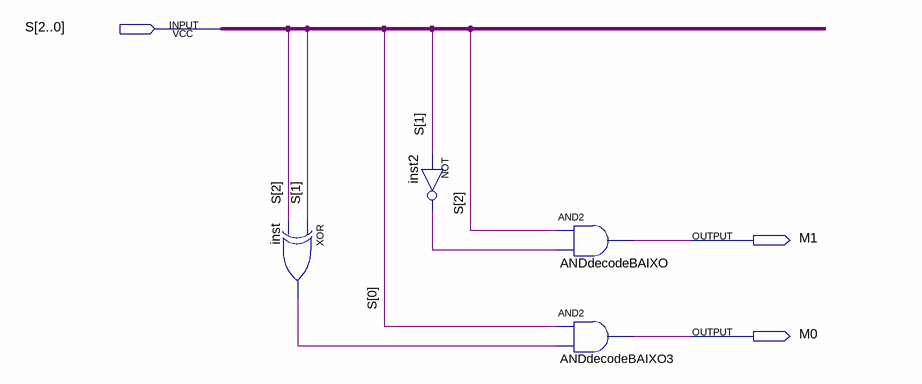
[diagram p0: schematic sheet]
// Quartus schematic decoder3x2comp.bdf as structural Verilog: 4 symbols, 3 pins
module decoder3x2comp (
  input  [2:0] S,
  output M1,
  output M0
);

  wire inst2_out, inst_out;

  xor inst (inst_out, S[1], S[2]);
  not inst2 (inst2_out, S[1]);
  and ANDdecodeBAIXO (M1, S[2], inst2_out);
  and ANDdecodeBAIXO3 (M0, S[0], inst_out);
endmodule
